# EAGLE design arduino_irobot_bridge (EAGLE 6.2)
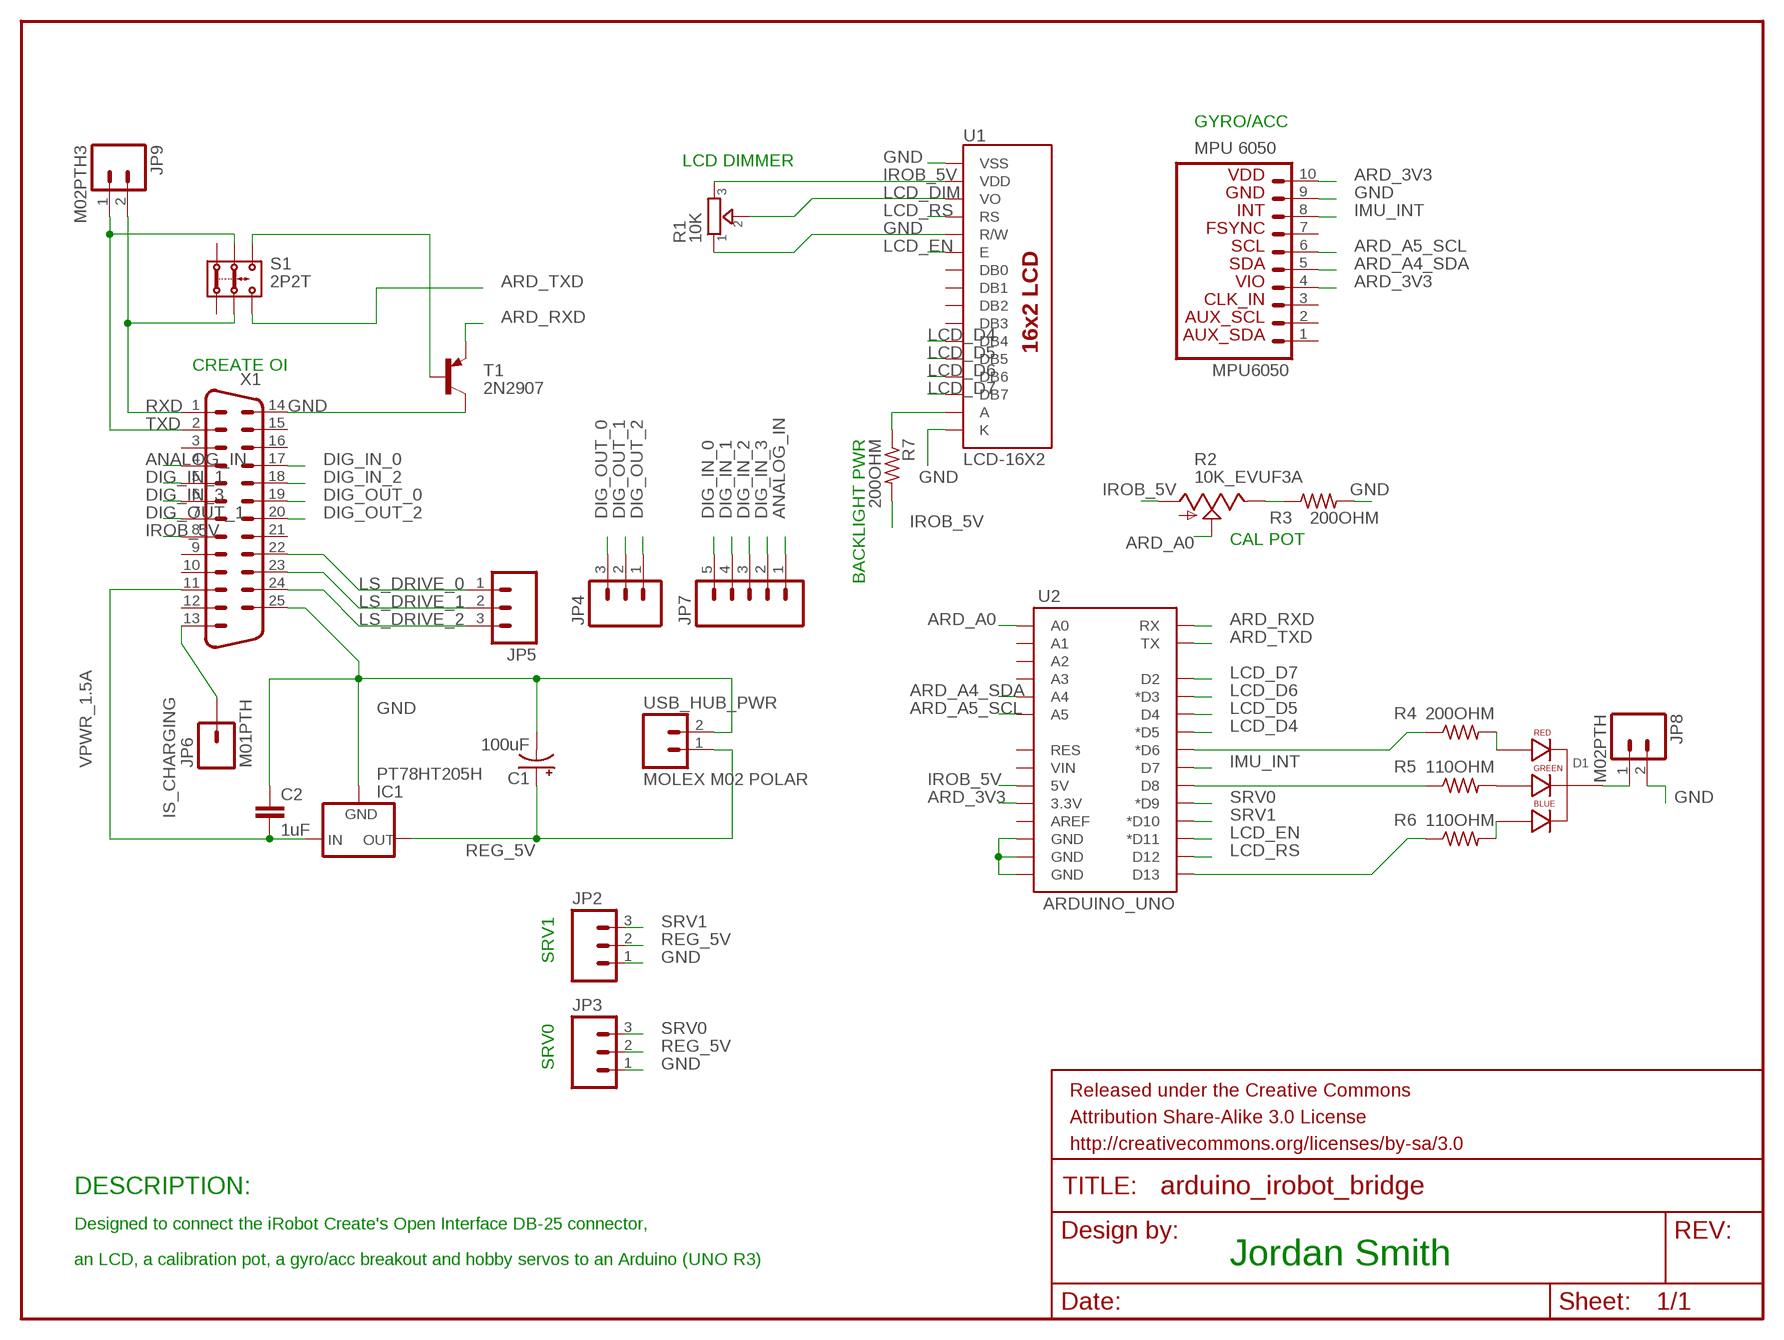
[diagram p0: schematic, sheet 1]

## Parts
C1  100uF  CAP_POLPTH1  [CPOL-RADIAL-100UF-25V]
C2  1uF  C2.5/2  [C2.5-2]
D1  LED-RGB-CC-THRUCLEAR  [LED-RGB-THRU]
FRAME1  FRAME-LETTER  [CREATIVE_COMMONS]
IC1  PT78HT205H  V_REG_78XXSINK  [TO220-IGO]
JP1  MPU6050  M10LOCK_LONGPADS  [1X10_LOCK_LONGPADS]
JP2  M03LOCK_LONGPADS  [1X03_LOCK_LONGPADS]
JP3  M03LOCK_LONGPADS  [1X03_LOCK_LONGPADS]
JP4  M03LONGPADS  [1X03_LONGPADS]
JP5  M03LONGPADS  [1X03_LONGPADS]
JP6  M01PTH  [1X01]
JP7  M05PTH_LONGPADS  [1X05_LONGPADS]
JP8  M02PTH  [1X02]
JP9  M02PTH3  [1X02_LONGPADS]
R1  10K  TRIMMER-3306F  [TRIMMER_3306F]
R2  10K_EVUF3A  US-EVUF3A  [EVUF]
R3  200OHM  R-US_0207/12  [0207/12]
R4  200OHM  R-US_0207/12  [0207/12]
R5  110OHM  R-US_0207/12  [0207/12]
R6  110OHM  R-US_0207/12  [0207/12]
R7  200OHM  R-US_0207/12  [0207/12]
S1  2P2T  [2P2T]
T1  2N2907  -PNP-TO92-EBC  [TO92-EBC]
U1  LCD-16X2  LCD-16X2SILK  [LCD-16X2]
U2  ARDUINO_UNO  ARDUINO_SHIELDLABEL  [DUEMILANOVE_SHIELD]
USB_HUB_PWR  MOLEX M02 POLAR  M02POLAR  [MOLEX-1X2]
X1  DB25VP  [M25VP]

## Nets
ANALOG_IN: JP7.1 X1.4
ARD_3V3: JP1.4(VIO) JP1.10(VDD_3V3) U2.3.3V
ARD_A0: R2.2(S) U2.A0
ARD_A4_SDA: JP1.5(SDA) U2.A4
ARD_A5_SCL: JP1.6(SCL) U2.A5
ARD_RXD: T1.E U2.RX
ARD_TXD: S1.3.2 U2.TX
DIG_IN_0: JP7.5 X1.17
DIG_IN_1: JP7.4 X1.5
DIG_IN_2: JP7.3 X1.18
DIG_IN_3: JP7.2 X1.6
DIG_OUT_0: JP4.3 X1.19
DIG_OUT_1: JP4.2 X1.7
DIG_OUT_2: JP4.1 X1.20
GND: C1.2(-) C2.1 IC1.GND JP1.9(GND) JP2.1 JP3.1 JP8.2 R1.1 R3.2 T1.C U1.1(VSS) U1.5(R/W) U1.16(K) U2.GND@0(GND) U2.GND@1(GND) U2.GND@2(GND) USB_HUB_PWR.2 X1.14 X1.25
IMU_INT: JP1.8(INT) U2.D7
IROB_5V: R1.3 R2.1(A) R7.2 U1.2(VDD) U2.5V X1.8
IS_CHARGING: JP6.1 X1.13
LCD_D4: U1.11(DB4) U2.D5(*D5)
LCD_D5: U1.12(DB5) U2.D4
LCD_D6: U1.13(DB6) U2.D3(*D3)
LCD_D7: U1.14(DB7) U2.D2
LCD_DIM: R1.2 U1.3(VO)
LCD_EN: U1.6(E) U2.D11(*D11)
LCD_RS: U1.4(RS) U2.D12
LS_DRIVE_0: JP5.1 X1.22
LS_DRIVE_1: JP5.2 X1.23
LS_DRIVE_2: JP5.3 X1.24
N$1: R7.1 U1.15(A)
N$2: R2.3(E) R3.1
N$3: D1.1(RED_CATHODE) R4.2
N$4: D1.3(GREEN_CATHODE) R5.2
N$5: D1.4(BLUE_CATHODE) R6.2
N$6: S1.3.1 T1.B
N$7: D1.2(CATHODE) JP8.1
N$9: R4.1 U2.D6(*D6)
N$10: R5.1 U2.D8
N$15: R6.1 U2.D13
REG_5V: C1.1(+) IC1.OUT JP2.2 JP3.2 USB_HUB_PWR.1
RXD: JP9.2 S1.2.2 X1.1
SRV0: JP3.3 U2.D9(*D9)
SRV1: JP2.3 U2.D10(*D10)
TXD: JP9.1 S1.2.1 X1.2
VPWR_1.5A: C2.2 IC1.IN X1.11
Unconnected: JP1.1(AUX_SDA) JP1.2(AUX_SCL) JP1.3(CLK_IN) JP1.7(FSYNC) S1.1.1 S1.1.2 U1.7(DB0) U1.8(DB1) U1.9(DB2) U1.10(DB3) U2.A1 U2.A2 U2.A3 U2.AREF U2.RES U2.VIN X1.3 X1.9 X1.10 X1.12 X1.15 X1.16 X1.21

## Notes on the sheet
- GYRO/ACC
- LCD DIMMER
- CREATE OI
- BACKLIGHT PWR
- CAL POT
- SRV1
- SRV0
- DESCRIPTION:
- Designed to connect the iRobot Create's Open Interface DB-25 connector,
- an LCD, a calibration pot, a gyro/acc breakout and hobby servos to an Arduino (UNO R3) | Jordan Smith

## Library data of the parts
C1 = SparkFun-Capacitors:CAP_POL: Capacitor Polarized These are standard SMD and PTH capacitors. Normally 10uF, 47uF, and 100uF in electrolytic and tantalum varieties. Always verify the external diameter of the through hole cap, it varies with capacity, voltage, and manufacturer. The EIA devices should be standard.
C2 = capacitor-wima:C: CAPACITOR naming: grid - package width
D1 = SparkFun-LED:LED-RGB-CC-THRU: RGB Through-hole common cathode LED SparkFun Storefront: COM-00105 (Clear) COM-09264 (Diffuse); PROD_ID: DIO-08418
FRAME1 = SparkFun-Aesthetics:FRAME-LETTER: Schematic Frame Standard 8.5x11 US Letter frame
IC1 = SparkFun-PowerIC:V_REG_78XX: Voltage Regulator Standard 7805 5V regulator. IGO (Input Ground Output). Spark Fun Electronics SKU : COM-00107
JP1 = MPU6050_breakout:M10: Header 10 Standard 10-pin 0.1" header. Use with straight break away headers (SKU : PRT-00116), right angle break away headers (PRT-00553), swiss pins (PRT-00743), machine pins (PRT-00117), and female headers (PRT-00115).
JP2-JP5 = SparkFun-Connectors:M03: Header 3 Standard 3-pin 0.1" header. Use with straight break away headers (SKU : PRT-00116), right angle break away headers (PRT-00553), swiss pins (PRT-00743), machine pins (PRT-00117), and female headers (PRT-00115). Molex polarized connector foot print use with SKU : PRT-08232 with associated crimp pins and housings.
JP6 = SparkFun-Connectors:M01: Header 1 Standard 1-pin 0.1" header. Use with straight break away headers (SKU : PRT-00116), right angle break away headers (PRT-00553), swiss pins (PRT-00743), machine pins (PRT-00117), and female headers (PRT-00115).
JP7 = SparkFun-Connectors:M05: Header 5 Standard 5-pin 0.1" header. Use with straight break away headers (SKU : PRT-00116), right angle break away headers (PRT-00553), swiss pins (PRT-00743), machine pins (PRT-00117), and female headers (PRT-00115). Molex polarized connector foot print use with SKU : PRT-08230 with associated crimp pins and housings.
JP8 JP9 USB_HUB_PWR = SparkFun-Connectors:M02: Standard 2-pin 0.1" header. Use with - straight break away headers ( PRT-00116) - right angle break away headers (PRT-00553) - swiss pins (PRT-00743) - machine pins (PRT-00117) - female headers (PRT-00115) Molex polarized connector foot print use with: PRT-08233 with associated crimp pins and housings. 2.54_SCREWTERM for use with PRT-10571. 3.5mm Screw Terminal footprints for PRT-08084 5mm Screw Terminal footprints for use with PRT-08433
R1 = dp_devices:TRIMMER: Trimmer resistor
R2 = pot:US-EVU: 9 mm Square Rotary Potentiometers Source: Panasonic
R3-R7 = resistor:R-US_: RESISTOR, American symbol
S1 = switch:2P2T: SLIDE SWITCH 2P2T Part No. SS-22F05-G(A)4 Source: CANAL ELECTRONIC CO., LTD .. switsch.pdf
T1 = transistor-neu-to92:*-PNP-: PNP Transistror
U1 = SparkFun-Displays:LCD-16X2: Standard text-only 16x2 parallel input LCD
U2 = SparkFun-Boards:ARDUINO_SHIELD: Arduino shield footprint
X1 = SparkFun-Connectors:DB25: Various DB25 connectors

## Board
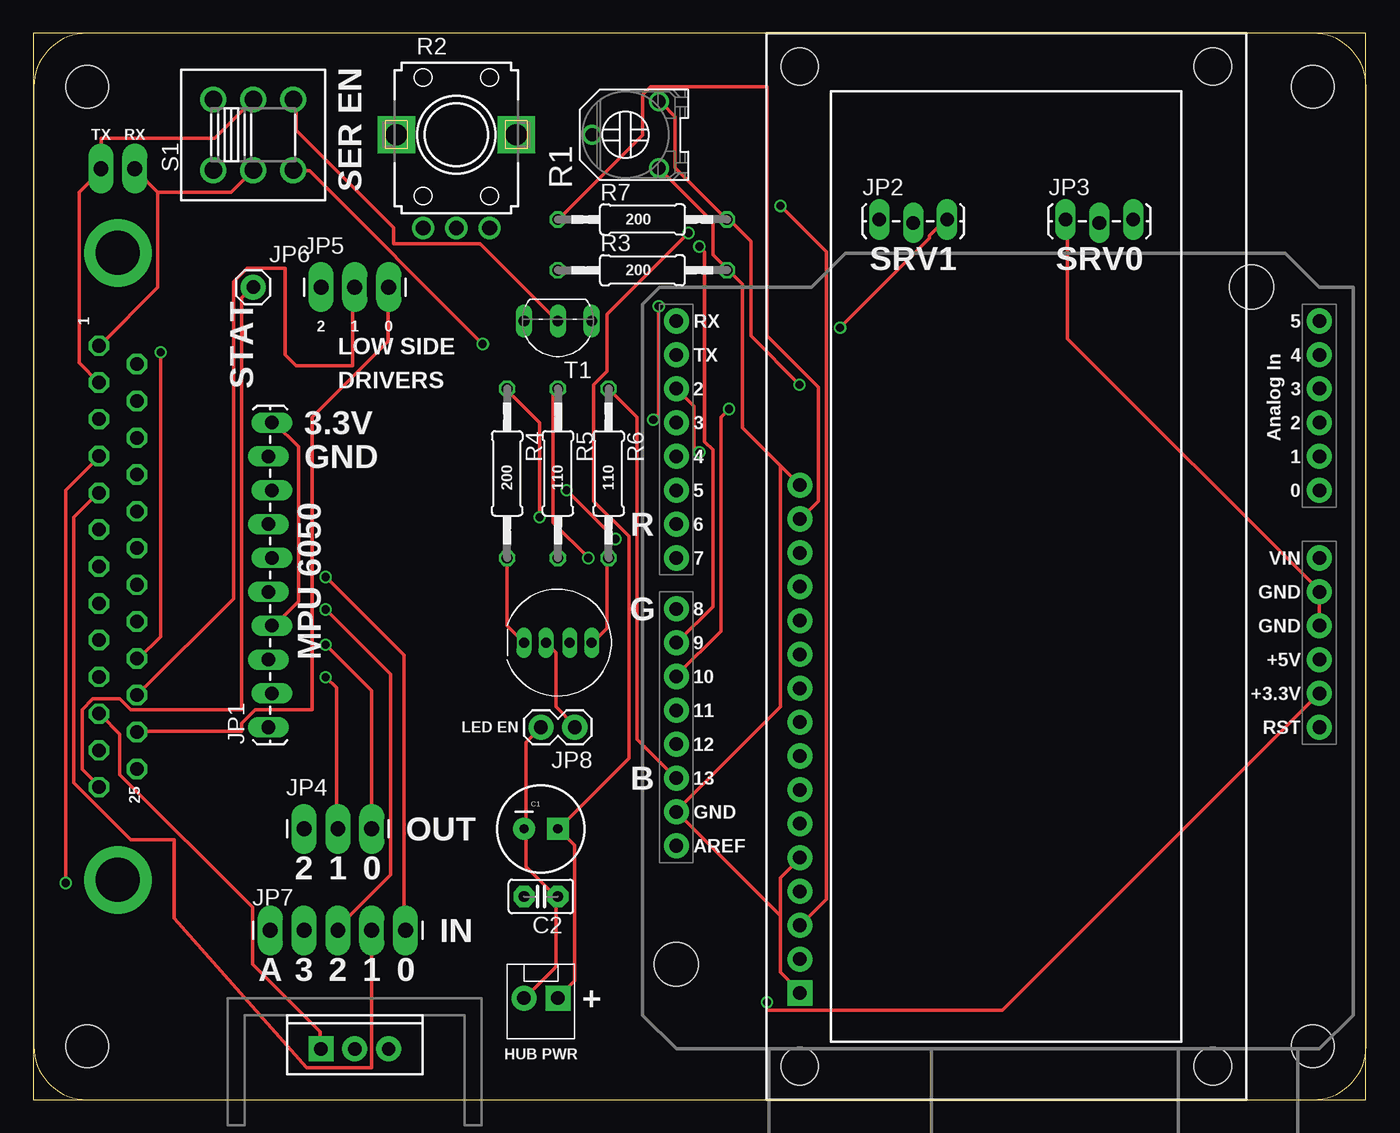
[diagram p1: board, top side]
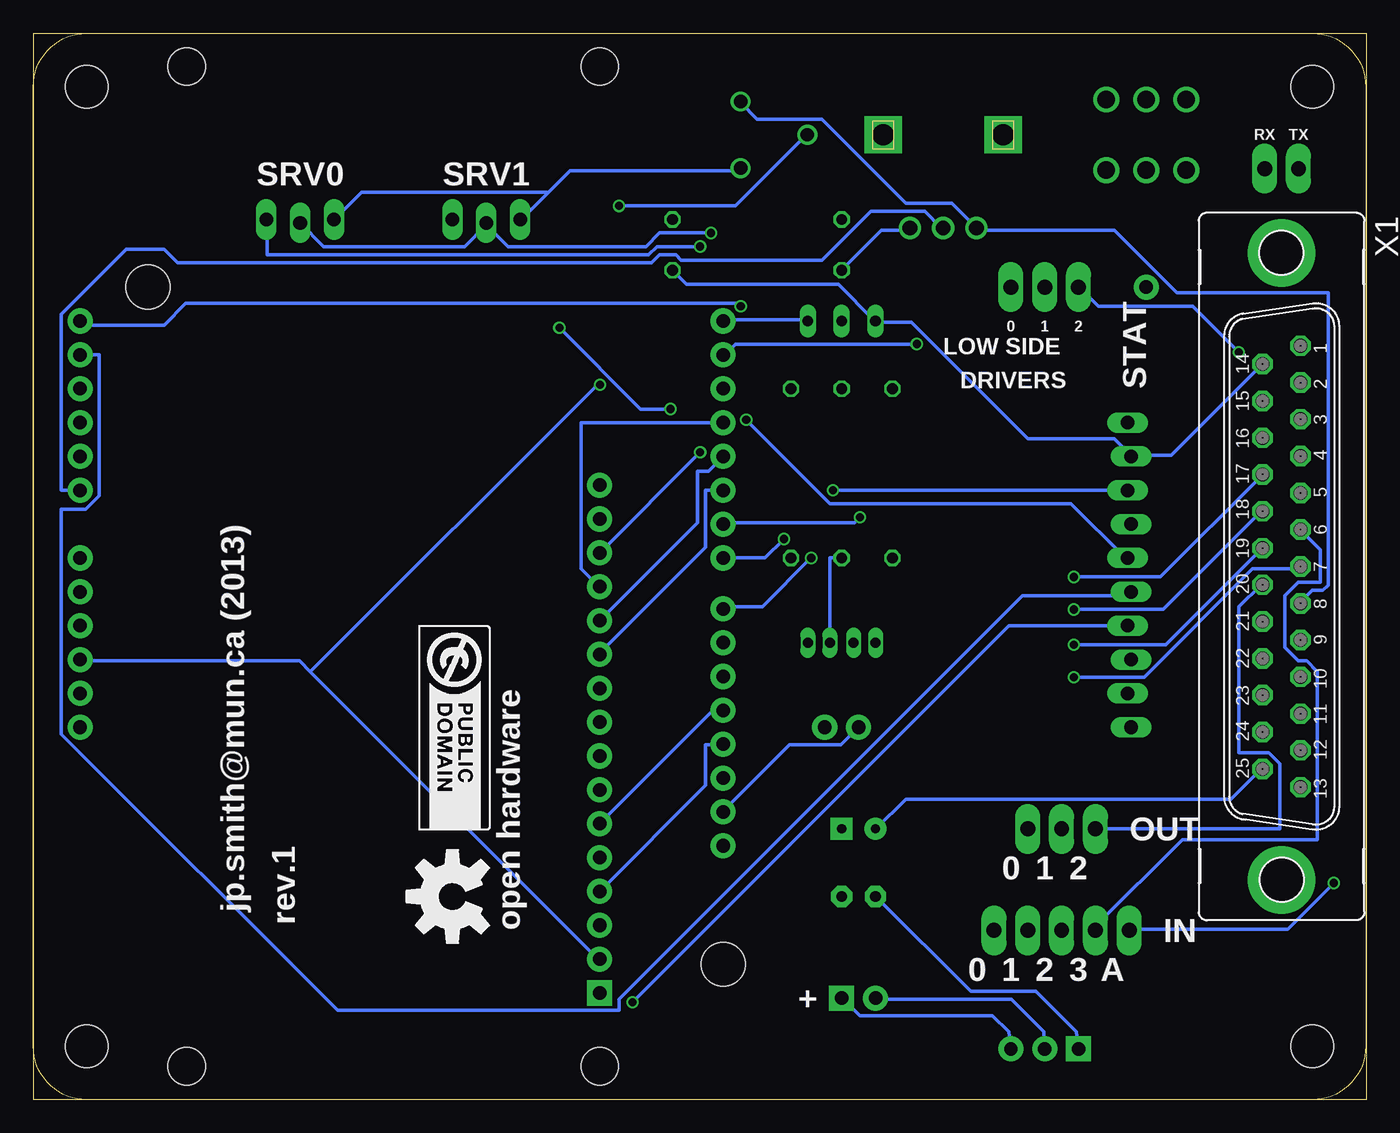
[diagram p2: board, bottom side, seen from below]

Size 100.04 x 80 mm. Coordinates in mm from the lower left corner, seen from the top.
Outline: 0,0 100,0 100,80 0,80 0,0
Copper layers (1*2*15*16): Top 0.035mm / dielectric 0.2mm / layer 2 0.0175mm / dielectric 1.1mm / layer 15 0.0175mm / dielectric 0.2mm / Bottom 0.035mm
Design rules: minimum track width 6mil, minimum drill 12mil, track to track 6mil, track to pad 6mil, pad to pad 6mil, via to via 6mil, smd to smd 0mil, copper to edge 10mil, drill to drill 10mil, minimum pad ring 6mil, minimum via ring 6mil, stop-mask expansion 2mil, vias tented up to drill 25mil, thermal gap 10mil

### Footprints (pad centres in the part's own frame; a part is rotated, then mirrored left to right if it is on the bottom)
CPOL-RADIAL-100UF-25V = drill 0.7 pad 1.651 square: 1 1.27,0 | drill 0.7 pad 1.651: 2 -1.27,0
C2.5-2 = drill 0.813 pad 1.6 octagon: 1 -1.27,0; 2 1.27,0
LED-RGB-THRU = drill 0.762 pad 0.889 long: 1 2.54,0; 2 0.889,0; 3 -0.889,0; 4 -2.54,0
TO220-IGO = drill 1 pad 1.88: GND 0,0; OUT 2.54,0 | drill 1 pad 1.88 square: IN -2.54,0
1X10_LOCK_LONGPADS = drill 1.016 long: 1 0,0.127; 2 2.54,-0.127; 3 5.08,0.127; 4 7.62,-0.127; 5 10.16,0.127; 6 12.7,-0.127; 7 15.24,0.127; 8 17.78,-0.127; 9 20.32,0.127; 10 22.86,-0.127
1X03_LOCK_LONGPADS = drill 1.016 long: 1 0,0; 2 2.54,-0.254; 3 5.08,0
1X03_LONGPADS = drill 1.118 pad 1.88 long: 1 0,0; 2 2.54,0; 3 5.08,0
1X01 = drill 1.016 pad 1.88: 1 0,0
1X05_LONGPADS = drill 1.118 pad 1.88 long: 1 0,0; 2 2.54,0; 3 5.08,0; 4 7.62,0; 5 10.16,0
1X02 = drill 1.016 pad 1.88: 1 0,0; 2 2.54,0
1X02_LONGPADS = drill 1.118 pad 1.88 long: 1 0,0; 2 2.54,0
TRIMMER_3306F = drill 1: 1 -2.5,-2.5; 2 0,2.5; 3 2.5,-2.5
EVUF = drill 1.1 pad 1.676: 1 -2.5,-7; 2 0,-7; 3 2.5,-7 | drill 1.6 pad 2.8 square: M1 4.5,0; M2 -4.5,0
0207/12 = drill 0.813 octagon: 1 -6.35,0; 2 6.35,0
2P2T = drill 1.3 pad 1.93: 1.1 -3,2.65; 1.2 -3,-2.65; 2.1 0,2.65; 2.2 0,-2.65; 3.1 3,2.65; 3.2 3,-2.65
TO92-EBC = drill 0.813 long: B 0,-1.27; C 2.54,-1.27; E -2.54,-1.27
LCD-16X2 = drill 1.016 pad 1.88 square: 1 -32,15.5 | drill 1.016 pad 1.88: 2 -29.46,15.5; 3 -26.92,15.5; 4 -24.38,15.5; 5 -21.84,15.5; 6 -19.3,15.5; 7 -16.76,15.5; 8 -14.22,15.5; 9 -11.68,15.5; 10 -9.14,15.5; 11 -6.6,15.5; 12 -4.06,15.5; 13 -1.52,15.5; 14 1.02,15.5; 15 3.56,15.5; 16 6.1,15.5 | hole 2.8: -37.5,15.5; -37.5,-15.5; 37.5,15.5; 37.5,-15.5
DUEMILANOVE_SHIELD = drill 1.016 pad 1.88: 3.3V 50.8,26.67; 5V 50.8,29.21; A0 50.8,41.91; A1 50.8,44.45; A2 50.8,46.99; A3 50.8,49.53; A4 50.8,52.07; A5 50.8,54.61; AREF 2.54,15.24; D2 2.54,49.53; D3 2.54,46.99; D4 2.54,44.45; D5 2.54,41.91; D6 2.54,39.37; D7 2.54,36.83; D8 2.54,33.02; D9 2.54,30.48; D10 2.54,27.94; D11 2.54,25.4; D12 2.54,22.86; D13 2.54,20.32; GND@0 50.8,31.75; GND@1 50.8,34.29; GND@2 2.54,17.78; RES 50.8,24.13; RX 2.54,54.61; TX 2.54,52.07; VIN 50.8,36.83 | hole 3.302: 45.72,57.15; 2.54,6.35
DP10080_V1 = hole 3.2: -46,-36; 46,-36; 46,36; -46,36
MOLEX-1X2 = drill 1.016 pad 1.88 square: 1 0,0 | drill 1.016 pad 1.88: 2 2.54,0
M25VP = drill 1.016 octagon: 1 -16.561,1.422; 2 -13.792,1.422; 3 -11.049,1.422; 4 -8.28,1.422; 5 -5.512,1.422; 6 -2.769,1.422; 7 0,1.422; 8 2.769,1.422; 9 5.512,1.422; 10 8.28,1.422; 11 11.049,1.422; 12 13.792,1.422; 13 16.561,1.422; 14 -15.189,-1.422; 15 -12.421,-1.422; 16 -9.652,-1.422; 17 -6.909,-1.422; 18 -4.14,-1.422; 19 -1.372,-1.422; 20 1.372,-1.422; 21 4.14,-1.422; 22 6.909,-1.422; 23 9.652,-1.422; 24 12.421,-1.422; 25 15.189,-1.422 | drill 3.302 pad 5.08: G1 -23.52,0; G2 23.52,0

### Placement (x,y rotation side)
C1  38.1,20.32 0 top
C2  38.1,15.24 180 top
D1  39.37,34.29 180 top
FRAME1  -77.47,113.03 0 top  (outside the outline)
IC1  24.13,3.81 0 top
JP1  17.78,27.94 90 top
JP2  63.5,66.04 0 top
JP3  77.47,66.04 0 top
JP4  20.32,20.32 0 top
JP5  21.59,60.96 0 top
JP6  16.51,60.96 0 top
JP7  17.78,12.7 0 top
JP8  40.64,27.94 180 top
JP9  5.08,69.85 0 top
R1  44.45,72.39 90 top
R2  31.75,72.39 0 top
R3  45.72,62.23 0 top
R4  35.56,46.99 270 top
R5  39.37,46.99 270 top
R6  43.18,46.99 270 top
R7  45.72,66.04 0 top
S1  16.51,72.39 0 top
T1  39.37,57.15 180 top
U1  73.03,40.01 90 top
U2  45.72,3.81 0 top
U$1  [DP10080_V1]  50.04,40.01 0 top
U$2  [DP10080_V1]  50.04,40.01 0 top
U$3  [DP10080_V1]  50.04,40.01 0 top
U$4  [OSHW-LOGO-L]  68.58,15.24 90 bottom
U$5  [LOGO_CC-0]  71.12,35.56 270 bottom
USB_HUB_PWR  39.37,7.62 180 top
X1  6.35,40.01 270 bottom

### Tracks (layer width: path | path; a pad name or v marks a point on that pad's centre or on a via)
ANALOG_IN  (via drill 0.61)
  Top 0.254: v2.44,16.26 2.44,45.72 4.88,48.16 X1.4
  Bottom 0.254: v2.44,16.26 5.89,12.8 17.68,12.8 JP7.1
ARD_3V3  (via drill 0.61)
  Top 0.254: JP1.4 18.09,35.56 19.91,37.39 19.91,48.97 18.09,50.8 JP1.10 | U2.3.3V 72.75,6.71 55.07,6.71 v55.07,7.32
  Bottom 0.254: v55.07,7.32 26.82,35.56 JP1.4
ARD_A0
  Bottom 0.254: U2.A0 97.94,45.72 97.94,58.93 93.07,63.8 90.22,63.8 89.2,62.79 53.65,62.79 53.03,63.4 51.82,63.4 51.41,62.99 40.84,62.99 37.19,66.65 33.12,66.65 31.9,65.43 R2.2
ARD_A4_SDA
  Bottom 0.254: U2.A4 95.1,55.88 95.1,45.31 96.11,44.3 97.94,44.3 97.94,27.43 77.22,6.71 56.08,6.71 56.08,7.52 25.81,37.8 17.88,37.8 17.68,38 JP1.5
ARD_A5_SCL  (via drill 0.61)
  Top 0.254: v46.53,51 46.94,51.41 v46.94,59.54
  Bottom 0.254: v46.53,51 40.23,44.7 22.15,44.7 18.09,40.64 JP1.6 | v46.94,59.54 47.14,59.74 88.59,59.74 90.22,58.12 96.32,58.12 96.52,58.32 U2.A5
ARD_RXD
  Bottom 0.254: T1.E 42.06,58.52 48.16,58.52 U2.RX
ARD_TXD  (via drill 0.61)
  Top 0.254: v33.73,56.69 20.73,69.7 19.71,69.7 S1.3.2
  Bottom 0.254: v33.73,56.69 47.35,56.69 48.16,55.88 U2.TX
DIG_IN_0  (via drill 0.61)
  Top 0.254: v21.95,39.22 27.84,33.33 27.84,12.8 JP7.5
  Bottom 0.254: v21.95,39.22 15.44,39.22 7.92,46.74 X1.17
DIG_IN_1
  Top 0.254: JP7.4 25.4,2.39 20.52,2.39 10.57,13.61 10.57,19.51 7.32,19.51 3.05,23.77 3.05,43.69 4.88,45.52 X1.5
DIG_IN_2  (via drill 0.61)
  Top 0.254: v21.95,36.78 26.82,31.9 26.82,16.87 22.96,13.01 22.96,12.8 JP7.3
  Bottom 0.254: v21.95,36.78 15.24,36.78 7.92,44.09 X1.18
DIG_IN_3
  Bottom 0.254: JP7.2 20.32,13.01 13.82,19.51 3.66,19.51 3.66,32.11 4.47,32.92 5.08,32.92 6.1,33.93 6.1,37.8 5.08,38.81 3.45,38.81 3.45,41.25 4.88,42.67 X1.6
DIG_OUT_0  (via drill 0.61)
  Top 0.254: v21.95,34.14 25.4,30.68 JP4.3
  Bottom 0.254: v21.95,34.14 15.04,34.14 7.92,41.25 X1.19
DIG_OUT_1  (via drill 0.61)
  Top 0.254: v21.95,31.7 22.76,30.89 22.76,20.32 JP4.2
  Bottom 0.254: v21.95,31.7 16.66,31.7 8.53,39.83 5.08,39.83 X1.7
DIG_OUT_2
  Bottom 0.254: JP4.1 6.5,20.32 6.5,25.2 7.32,26.01 9.55,26.01 9.55,36.98 7.92,38.61 X1.20
GND
  Top 0.254: 56.08,13.82 56.08,16.66 57.51,18.09 U1.5 | 56.08,13.82 56.08,9.55 57.51,8.13 U1.1 | 56.08,13.82 48.36,21.54 U2.GND@2 48.36,21.74 56.08,29.46 56.08,47.55 | 39.22,15.24 36.98,17.48 36.98,20.32 | JP8.2 36.98,26.82 36.98,20.32 | 36.98,20.32 C1.2 | 39.22,15.24 39.22,9.96 36.98,7.72 USB_HUB_PWR.2 | 39.22,15.24 C2.1 | U2.GND@0 U2.GND@1 96.52,38.2 77.62,57.1 77.62,66.04 JP3.1 | R1.1 51,65.84 51,63.4 52.02,62.38 R3.2 52.22,62.18 53.24,61.16 53.24,50.39 56.08,47.55 | 56.08,47.55 57.51,46.13 U1.16
  Bottom 0.254: IC1.GND 24.18,5.08 26.62,7.52 36.78,7.52 USB_HUB_PWR.2 | X1.25 7.92,24.79 10.16,22.55 34.54,22.55 36.78,20.32 C1.2 | JP8.2 39.42,26.62 43.28,26.62 48.16,21.74 U2.GND@2 | X1.14 7.92,55.07 14.63,48.36 17.48,48.36 JP1.9 17.68,48.36 18.9,49.58 25.4,49.58 34.14,58.32 36.78,58.32 T1.C 36.98,58.52 39.62,61.16 51,61.16 R3.2 | 61.37,68.07 59.74,69.7 47.14,69.7 R1.1 | 61.37,68.07 63.4,66.04 JP2.1 | 61.37,68.07 75.39,68.07 77.42,66.04 JP3.1
IMU_INT  (via drill 0.61)
  Top 0.254: v43.69,42.06 v40.03,45.72
  Bottom 0.254: v40.03,45.72 JP1.8 | v43.69,42.06 45.11,40.64 U2.D7
IROB_5V  (via drill 0.61)
  Top 0.254: R1.3 47.14,74.78 48.16,73.76 48.16,69.9 52.02,66.04 R7.2 52.22,66.04 53.85,64.41 53.85,57.3 v57.51,53.65
  Bottom 0.254: 79.25,32.11 80.06,32.92 96.52,32.92 U2.5V | 79.25,32.11 57.71,10.57 U1.2 | X1.8 4.88,37.39 4.06,38.2 3.25,38.2 2.85,38.61 2.85,60.55 14.22,60.55 18.9,65.23 29.06,65.23 R2.1 29.26,65.43 31.09,67.26 34.54,67.26 40.84,73.56 45.72,73.56 46.94,74.78 R1.3 | 79.25,32.11 57.71,53.65 v57.51,53.65
IS_CHARGING
  Top 0.254: X1.13 4.88,23.57 3.66,24.79 3.66,29.26 4.47,30.07 6.5,30.07 7.32,29.26 15.65,29.26 15.65,60.15 16.46,60.96 JP6.1
LCD_D4
  Bottom 0.254: U2.D5 49.58,45.72 49.58,41.45 57.51,33.53 U1.11
LCD_D5
  Bottom 0.254: U2.D4 49.38,47.14 50.19,47.14 50.19,43.28 57.51,35.97 U1.12
LCD_D6
  Bottom 0.254: U2.D3 58.93,50.8 58.93,39.83 57.71,38.61 U1.13
LCD_D7  (via drill 0.61)
  Top 0.254: v49.99,48.56 49.58,48.97 49.58,52.02 U2.D2
  Bottom 0.254: v49.99,48.56 57.51,41.05 U1.14
LCD_DIM  (via drill 0.61)
  Top 0.254: v56.08,67.06 59.54,63.6 59.54,15.04 57.71,13.21 U1.3
  Bottom 0.254: v56.08,67.06 47.35,67.06 42.06,72.34 R1.2
LCD_EN
  Bottom 0.254: U1.6 57.51,20.73 49.17,29.06 48.36,29.06 U2.D11
LCD_RS
  Bottom 0.254: U1.4 57.51,15.65 49.58,23.57 49.58,26.62 48.36,26.62 U2.D12
LS_DRIVE_0  (via drill 0.61)
  Top 0.254: v9.55,56.08 9.55,34.75 7.92,33.12 X1.22
  Bottom 0.254: v9.55,56.08 13.01,59.54 20.12,59.54 21.54,60.96 JP5.1
LS_DRIVE_1
  Top 0.254: X1.23 7.92,30.48 15.04,37.59 15.04,61.37 16.05,62.38 18.9,62.38 18.9,55.88 19.71,55.07 23.98,55.07 23.98,60.96 JP5.2
LS_DRIVE_2
  Top 0.254: X1.24 7.92,27.64 15.65,27.64 15.65,28.25 16.66,29.26 20.93,29.26 20.93,51.21 26.62,56.9 26.62,60.96 JP5.3
N$1
  Top 0.254: R7.1 39.42,66.04 45.72,72.34 45.72,75.39 46.33,76 55.07,76 55.07,57.3 58.93,53.44 58.93,44.91 57.71,43.69 U1.15
N$2
  Bottom 0.254: R3.1 36.37,65.23 34.34,65.23 R2.3
N$3
  Top 0.254: D1.1 35.56,35.56 R4.2
N$4
  Bottom 0.254: R5.2 40.23,40.64 40.23,34.34 D1.3
N$5
  Top 0.254: D1.4 42.06,34.34 43.08,35.36 43.08,40.64 R6.2
N$6
  Top 0.254: T1.B 39.22,58.52 33.53,64.21 27.03,64.21 27.03,65.43 19.71,72.75 19.71,74.98 S1.3.1
N$7
  Top 0.254: D1.2 38.61,34.14 39.22,33.53 39.22,29.46 40.64,28.04 JP8.1
N$9  (via drill 0.61)
  Top 0.254: v38,43.69 38,50.8 35.56,53.24 R4.1
  Bottom 0.254: v38,43.69 38.41,43.28 48.16,43.28 U2.D6
N$10  (via drill 0.61)
  Top 0.254: v41.66,40.64 39.01,43.28 39.01,53.03 39.22,53.24 R5.1
  Bottom 0.254: v41.66,40.64 45.31,36.98 48.16,36.98 U2.D8
N$15
  Top 0.254: R6.1 45.31,51.21 45.31,27.03 48.16,24.18 U2.D13
REG_5V  (via drill 0.61)
  Top 0.254: 39.42,20.32 40.64,19.1 40.64,8.94 39.42,7.72 USB_HUB_PWR.1 | v49.17,65.02 43.08,58.93 43.08,54.66 42.06,53.65 42.06,44.91 44.7,42.27 44.7,25.6 39.42,20.32 | 39.42,20.32 C1.1
  Bottom 0.254: 66.04,65.63 67.67,64.01 78.23,64.01 JP3.2 | IC1.OUT 26.82,5.08 28.04,6.3 38,6.3 39.22,7.52 USB_HUB_PWR.1 | 66.04,65.63 64.41,64.01 54.05,64.01 53.03,65.02 v49.17,65.02 | 66.04,65.63 JP2.2
RXD
  Top 0.254: 9.35,68.07 9.35,60.96 5.08,56.69 X1.1 | 9.35,68.07 7.72,69.7 JP9.2 | 9.35,68.07 14.83,68.07 16.46,69.7 S1.2.2
SRV0  (via drill 0.61)
  Top 0.254: v49.99,64.01 50.39,63.6 50.39,49.38 51,48.77 51,36.98 48.36,34.34 U2.D9
  Bottom 0.254: v49.99,64.01 53.24,64.01 53.85,63.4 82.5,63.4 82.5,66.04 JP3.3
SRV1  (via drill 0.61)
  Top 0.254: v60.55,57.91 67.26,64.62 67.26,64.82 68.48,66.04 JP2.3 | v52.22,51.82 51.61,51.21 51.61,35.15 48.36,31.9 U2.D10
  Bottom 0.254: v60.55,57.91 54.46,51.82 v52.22,51.82
TXD
  Top 0.254: X1.2 3.45,55.27 3.45,68.07 5.08,69.7 JP9.1 5.08,72.14 13.61,72.14 16.46,74.98 S1.2.1
VPWR_1.5A
  Top 0.254: X1.11 5.08,28.85 6.5,27.43 6.5,24.38 16.46,14.43 16.46,10.16 21.54,5.08 IC1.IN
  Bottom 0.254: C2.2 36.78,15.24 29.67,8.13 24.79,8.13 21.74,5.08 IC1.IN

### Text on the board
tPlace: SER EN | TX | RX | 200 | 200 | SRV1 | SRV0 | 1 | 2 | 1 | 0 | LOW SIDE | STAT | DRIVERS | 3.3V | GND | 200 | 110 | 110 | R | G | MPU 6050 | LED EN | B | 25 | OUT | 2 | 1 | 0 | IN | A | 3 | 2 | 1 | 0 | + | HUB PWR
bPlace: TX | RX | SRV1 | SRV0 | 2 | 1 | 0 | LOW SIDE | STAT | DRIVERS | jp.smith@mun.ca (2013) | OUT | rev.1 | 2 | 1 | 0 | IN | open hardware | A | 3 | 2 | 1 | 0 | +